# EasyEDA Pro project bldc-high-current-2-easyeda.epro, board PCB1
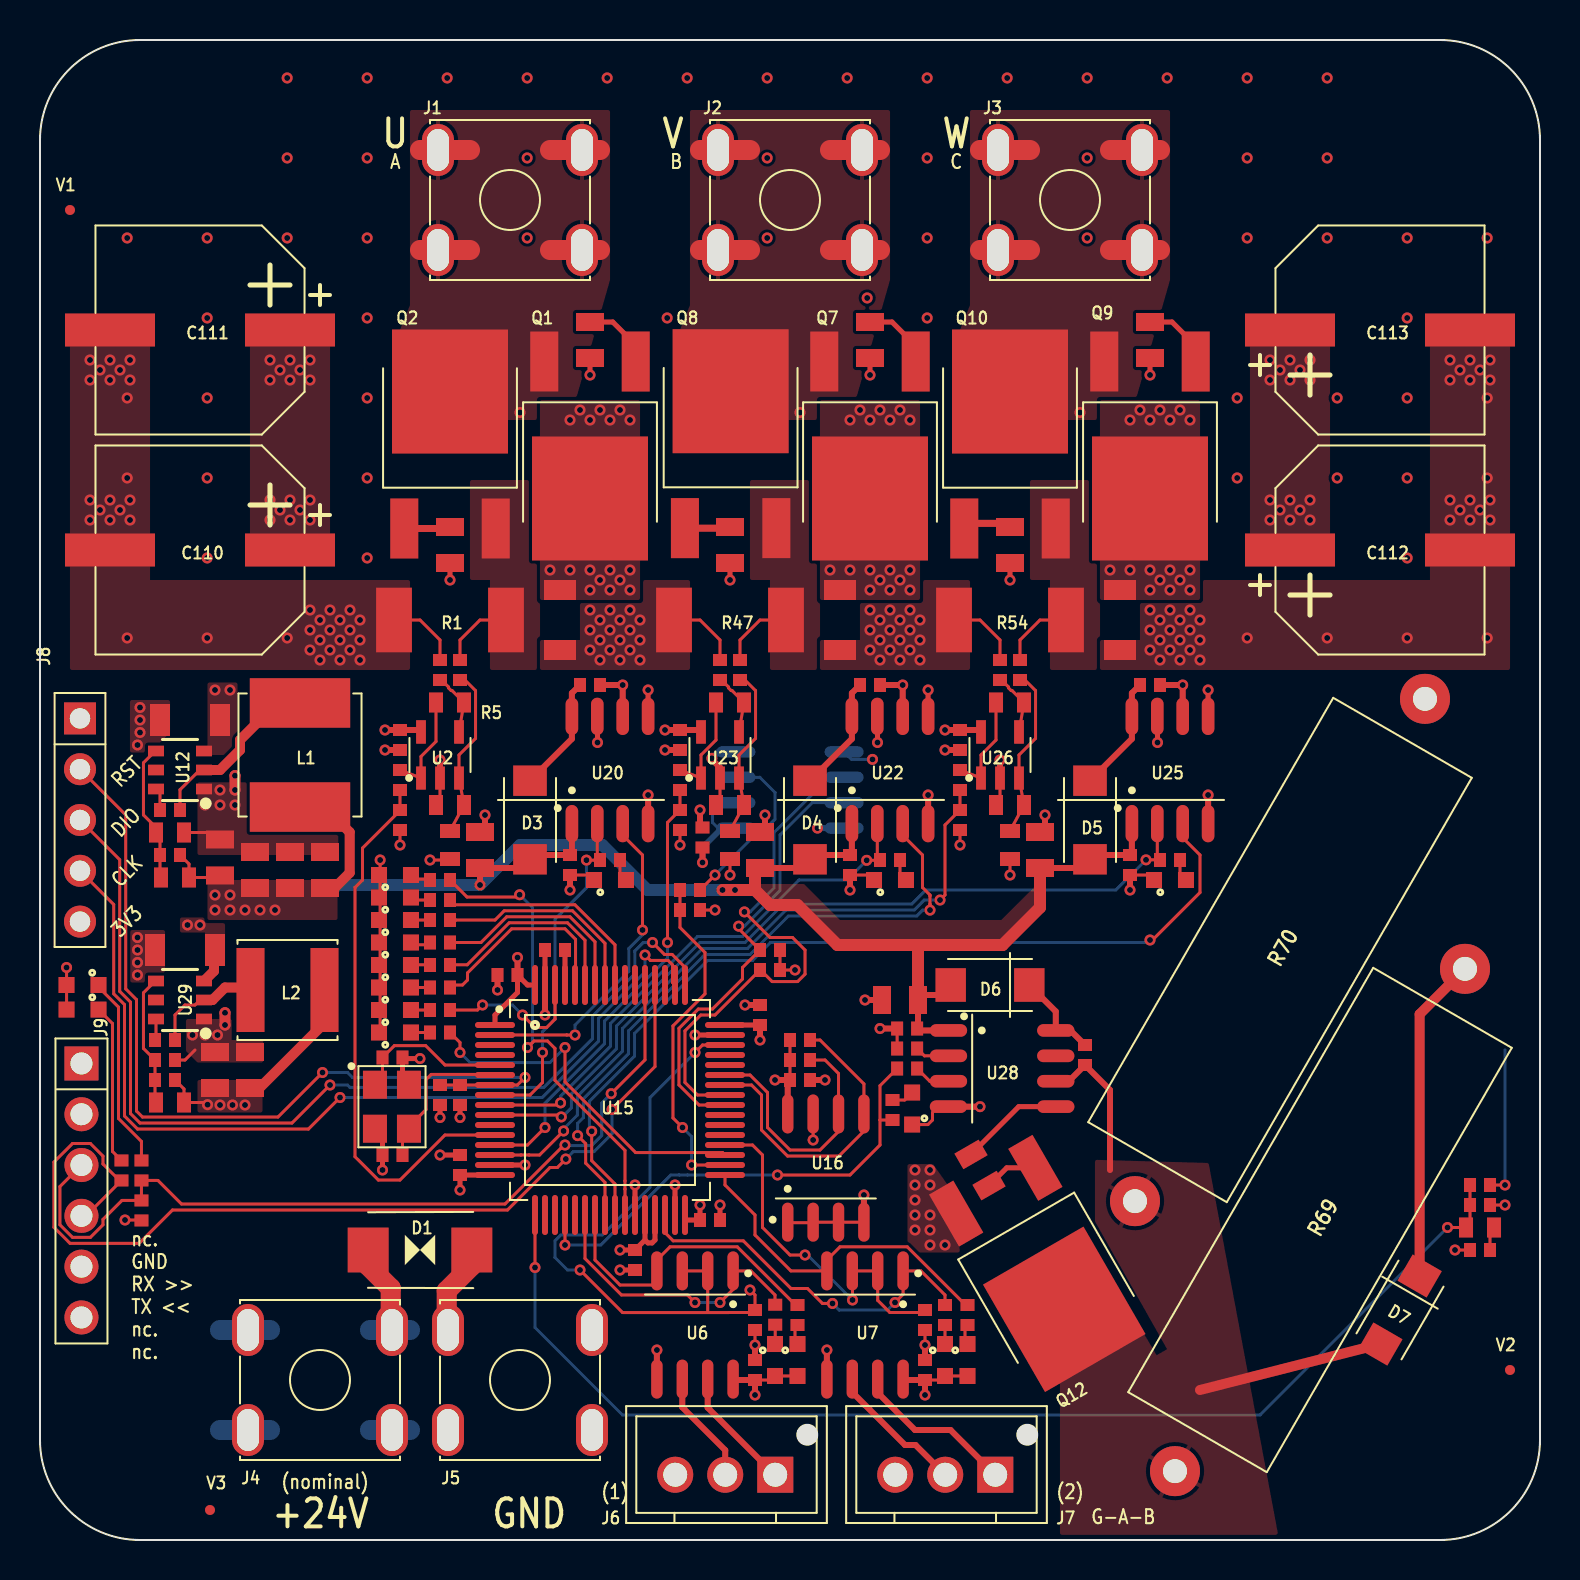
[diagram p3: board, top side]
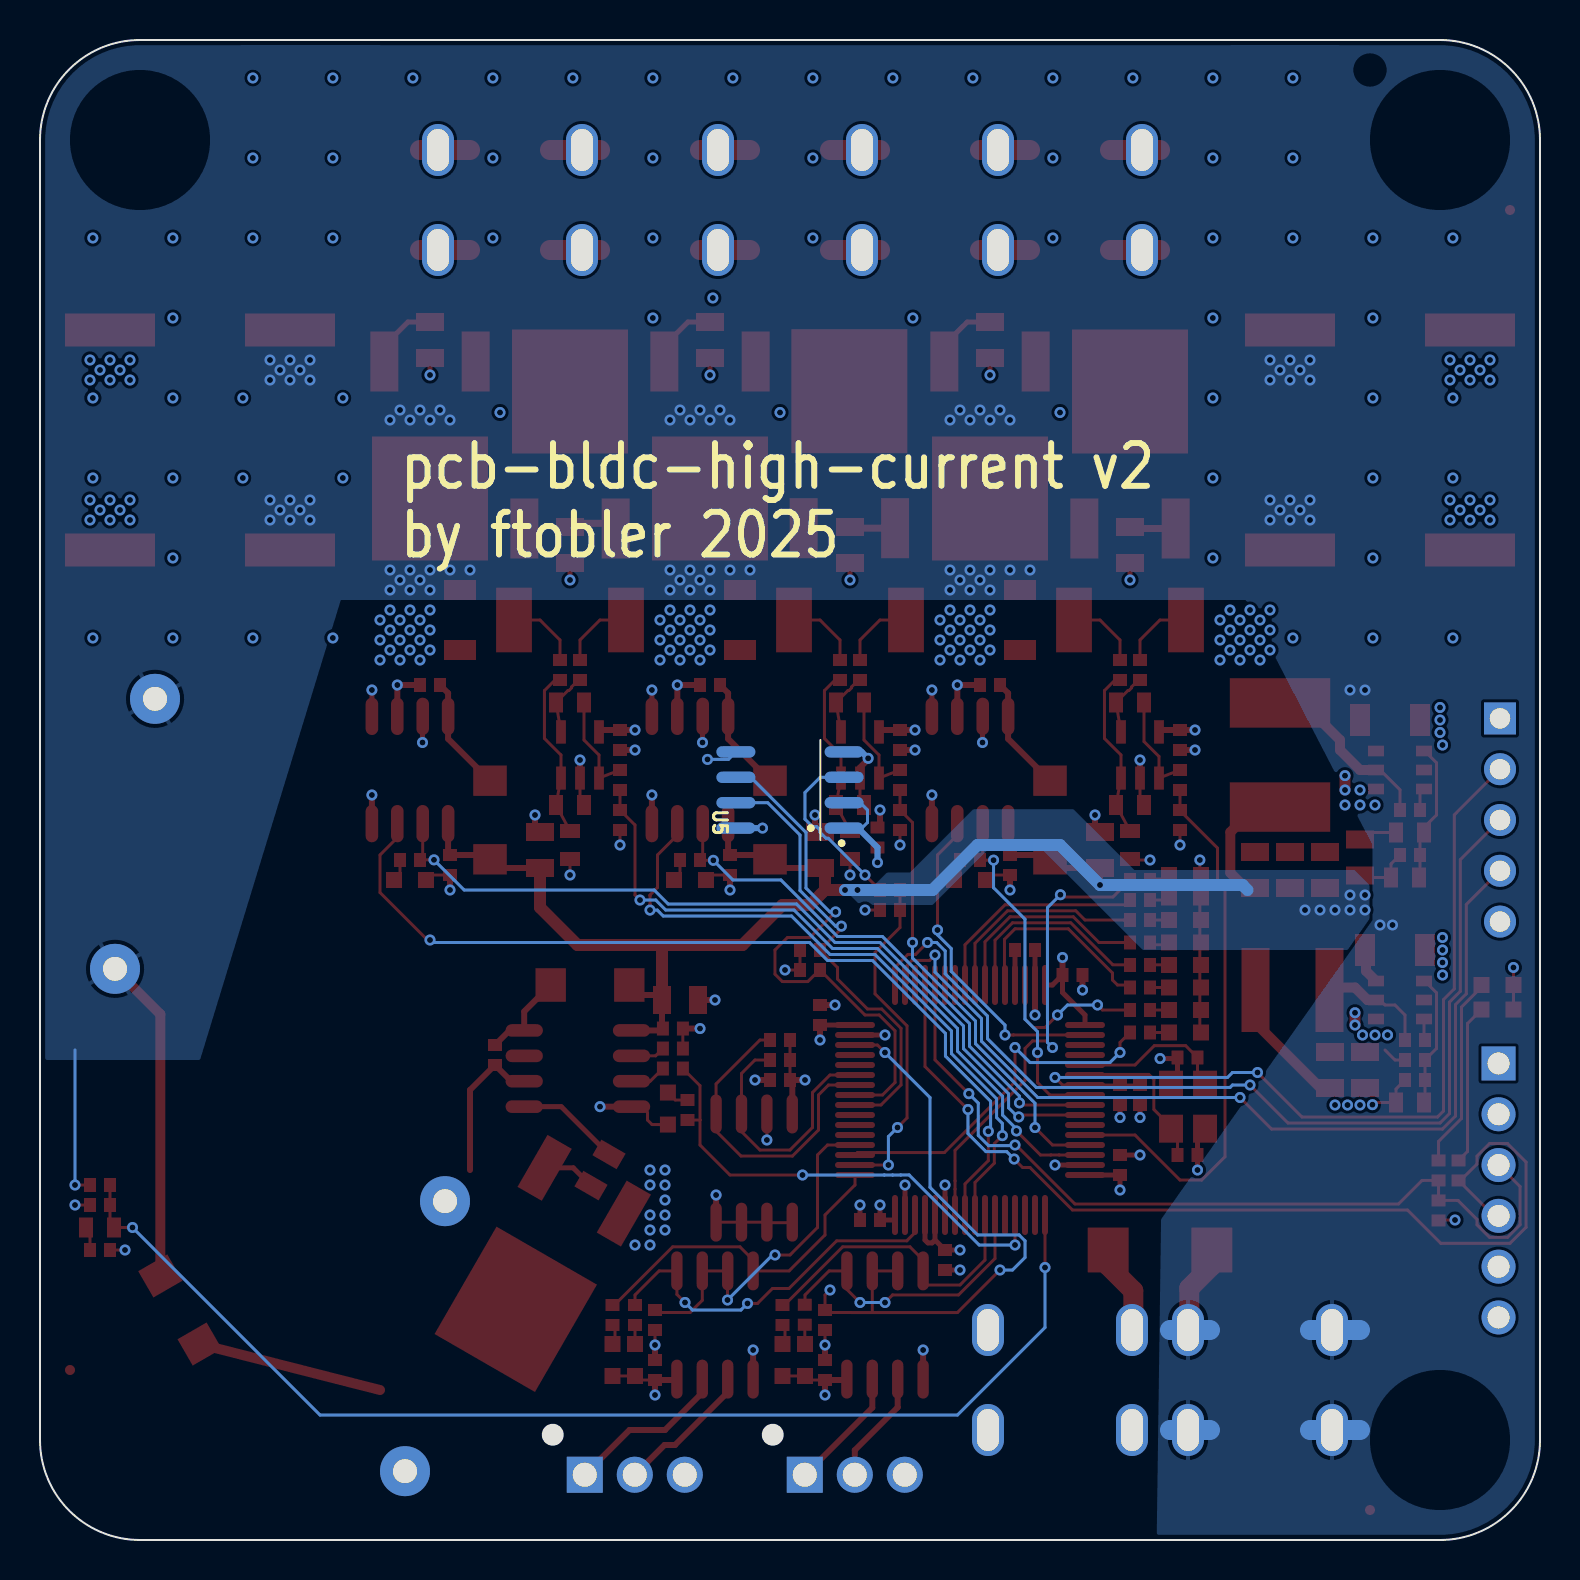
[diagram p4: board, bottom side, seen from below]

Outline 75 x 75 mm; copper layers: Top Layer, Inner1, Inner2, Bottom Layer. Coordinates in mm from the lower left corner of the outline.
Outline path: 0,70 arc(1.46,73.54) 5,75 70,75 arc(73.54,73.54) 75,70 75,5 arc(73.54,1.46) 70,0 5,0 arc(1.46,1.46) 0,5 0,70
Stack: Top Layer 0.035mm Outer layer thickness 1oz / Dielectric1 0.2104mm 7628 RC49% 8.6mil / Inner1 0.0152mm Inner layer thickness / Dielectric2 1.065mm 1.1mm H/HOZ Copper / Inner2 0.0152mm Inner layer thickness / Dielectric3 0.2104mm 7628 RC49% 8.6mil / Bottom Layer 0.035mm Outer layer thickness 1oz

## Design rules (mm)
template: Custom Config
spacing copperThickness1oz (default): track to track 0.15, other pairs 0.152 to 0.3
spacing copperThickness2oz: track to track 0.203, other pairs 0.152 to 0.3
track width copperThickness1oz (default): min 0.127, default 0.15, max 2.54
track width copperThickness2oz: min 0.203, default 0.254, max 2.54
differential pair differentialPair (default): width min 0.127, default 0.254, max 2.54; gap min 0.152, default 0.152
via viaSize (default): diameter min 0.55, default 0.55, max 10; hole min 0.3, default 0.3, max 6.3
net $1N1999 uses copperRegion No Spoke
net GND uses copperRegion No Spoke
net 3V3 uses copperRegion No Spoke
net OUT_A uses copperRegion No Spoke
net 12V uses copperRegion No Spoke
net $1N98362 uses copperRegion No Spoke
net $1N99332 uses copperRegion No Spoke
net OUT_BRAKE uses copperRegion No Spoke
net 24V uses copperRegion No Spoke
net OUT_B uses copperRegion No Spoke
net OUT_C uses copperRegion No Spoke

## Placement (name value [footprint] x y rotation side)
C4  1nF  [C0402]  32.5 31.5 180 top
C9  10uF  [C1206]  7.5 41 0 top
C43  1nF  [C0402]  18 36 90 top
C46  10pF  [C0402]  17.62 19.25 0 top
C47  10pF  [C0402]  17.62 24.12 180 top
C54  68pF  [C0603]  6.5 21.88 0 top
C55  47uF  [C0805]  8.75 23.5 270 top
C96  10uF  [C1206]  26 46 90 top
C97  10uF  [C1206]  40 46 90 top
C98  10uF  [C1206]  54 46 90 top
C100  10uF  [C1206]  7.25 29.5 0 top
C107  47uF  [C0805]  10.5 23.5 270 top
C109  68pF  [C0603]  6.75 33.13 0 top
C110  470uF  [CAP-SMD_BD10.0-L10.3-W10.3-FD]  8 49.5 180 top
C111  470uF  [CAP-SMD_BD10.0-L10.3-W10.3-FD]  8 60.5 180 top
C112  470uF  [CAP-SMD_BD10.0-L10.3-W10.3-FD]  67 49.5 0 top
C113  470uF  [CAP-SMD_BD10.0-L10.3-W10.3-FD]  67 60.5 0 top
C116  1nF  [C0402]  32 36 90 top
C117  1nF  [C0402]  46 36 90 top
C118  10uF  [C0805]  43 27 0 top
C119  10uF  [C0805]  22 34.5 270 top
C120  10uF  [C0805]  36 34.5 270 top
C121  10uF  [C0805]  50 34.5 270 top
C122  10uF  [C0805]  9 34.13 270 top
C123  10uF  [C0805]  10.75 33.5 270 top
C124  10uF  [C0805]  12.5 33.5 270 top
C125  10uF  [C0805]  14.25 33.5 270 top
C126  1nF  [C0402]  72 16.75 180 top
C137  100nF  [C0402]  6.25 25 180 top
C138  100nF  [C0402]  6.5 36.5 180 top
C139  100nF  [C0402]  26.5 33.75 90 top
C143  100nF  [C0402]  41.5 42.75 180 top
C144  100nF  [C0402]  54.5 33.75 90 top
C145  100nF  [C0402]  55.5 42.75 180 top
C146  100nF  [C0402]  46 40 90 top
C147  100nF  [C0402]  32 40 90 top
C148  100nF  [C0402]  43.36 25.57 0 top
C151  100nF  [C0402]  27.5 42.75 180 top
C152  100nF  [C0402]  18 40 90 top
C153  100nF  [C0402]  40.5 33.75 90 top
C154  100nF  [C0402]  52.25 24.25 90 top
C155  100nF  [C0402]  21 18.75 270 top
C156  100nF  [C0402]  29.75 14 90 top
C157  100nF  [C0402]  36 26.25 270 top
C158  100nF  [C0402]  23.38 28.25 0 top
C159  100nF  [C0402]  33.5 16 180 top
C160  100nF  [C0402]  44.25 8.5 270 top
C161  100nF  [C0402]  35.75 8.5 270 top
C162  100nF  [C0402]  33.12 35.12 270 top
C163  100nF  [C0402]  38 23 180 top
C164  100nF  [C0402]  20 22.25 90 top
D1  SMBJ24CA  [SMB_L4.6-W3.6-LS5.3-BI]  19 14.5 0 top
D3  SS14  [SMA_L4.2-W2.6-LS5.0-RD_1]  24.5 36 270 top
D4  SS14  [SMA_L4.2-W2.6-LS5.0-RD_1]  38.5 36 270 top
D5  SS14  [SMA_L4.2-W2.6-LS5.0-RD_1]  52.5 36 270 top
D6  SS14  [SMA_L4.2-W2.6-LS5.0-RD_1]  47.5 27.75 180 top
D7  SS14  [SMA_L4.2-W2.6-LS5.0-RD_1]  68 11.5 240 top
J1  T34080080-0680  [CONN-TH_T34080080-0680]  23.5 67 0 top
J2  T34080080-0680  [CONN-TH_T34080080-0680]  37.5 67 0 top
J3  T34080080-0680  [CONN-TH_T34080080-0680]  51.5 67 0 top
J4  T34080080-0680  [CONN-TH_T34080080-0680]  14 8 180 top
J5  T34080080-0680  [CONN-TH_T34080080-0680]  24 8 180 top
J6  B3B-XH-AM-BK(LF)(SN)  [CONN-TH_B3B-XH-AM-BK-LF-SN]  34.26 3.26 180 top
J7  B3B-XH-AM-BK(LF)(SN)  [CONN-TH_B3B-XH-AM-BK-LF-SN]  45.26 3.26 180 top
J8  PH2.54-1X5P-H25  [HDR-TH_5P-P2.54-V-M-3]  2 36 270 top
J9  PH2.54-06PB2G-H25  [HDR-TH_6P-P2.54-V-M_BLUE]  2.07 17.48 270 top
L1  12uH  [IND-SMD_L6.0-W6.0_SWPA6045S]  13 39.25 270 top
L2  6.8uH  [IND-SMD_L5.0-W5.0_SWPA5040S]  12.38 27.5 0 top
LED1  KT-0603R  [LED0603-RD]  17.75 33.25 0 top
LED2  KT-0603R  [LED0603-RD]  17.75 32.12 0 top
LED3  KT-0603R  [LED0603-RD]  17.75 31 0 top
LED4  KT-0603R  [LED0603-RD]  17.75 29.88 0 top
LED5  KT-0603R  [LED0603-RD]  17.75 28.75 0 top
LED6  KT-0603R  [LED0603-RD]  17.75 27.62 0 top
LED7  KT-0603R  [LED0603-RD]  17.75 26.5 0 top
LED8  KT-0603R  [LED0603-RD]  17.75 25.38 0 top
LED9  KT-0603R  [LED0603-RD]  37.88 9 270 top
LED10  KT-0603R  [LED0603-RD]  36.75 9 270 top
LED11  KT-0603R  [LED0603-RD]  46.38 9 270 top
LED12  KT-0603R  [LED0603-RD]  45.25 9 270 top
LED13  KT-0603R  [LED0603-RD]  2.12 27.75 180 top
LED14  KT-0603R  [LED0603-RD]  2.13 26.52 180 top
LED15  KT-0603R  [LED0603-RD]  43.61 21.57 90 top
LED16  KT-0603R  [LED0603-RD]  28.5 33 0 top
LED17  KT-0603R  [LED0603-RD]  42.5 33 0 top
LED18  KT-0603R  [LED0603-RD]  56.5 33 0 top
Q1  DOD100N04  [TO-252-2_L6.6-W6.2-P4.57-LS10.1-BR-CW]  27.5 55.5 90 top
Q2  DOD100N04  [TO-252-2_L6.6-W6.2-P4.57-LS10.1-BR-CW]  20.5 54 270 top
Q7  DOD100N04  [TO-252-2_L6.6-W6.2-P4.57-LS10.1-BR-CW]  41.5 55.5 90 top
Q8  DOD100N04  [TO-252-2_L6.6-W6.2-P4.57-LS10.1-BR-CW]  34.53 54.02 270 top
Q9  DOD100N04  [TO-252-2_L6.6-W6.2-P4.57-LS10.1-BR-CW]  55.5 55.5 90 top
Q10  DOD100N04  [TO-252-2_L6.6-W6.2-P4.57-LS10.1-BR-CW]  48.5 54 270 top
Q12  DOD100N04  [TO-252-2_L6.6-W6.2-P4.57-LS10.1-BR-CW]  49.5 14.5 120 top
R1  2mΩ  [RES-SMD_L6.4-W3.2-1]  20.5 46 0 top
R5  100kΩ  [R0603]  20.5 41.88 180 top
R6  100kΩ  [R0603]  20.5 36.75 180 top
R31  2.7kΩ  [R0603]  6.5 35.38 180 top
R39  51kΩ  [R0402]  6.5 34.25 0 top
R44  100kΩ  [R0603]  34.5 41.88 180 top
R45  100kΩ  [R0603]  34.5 36.75 180 top
R47  2mΩ  [RES-SMD_L6.4-W3.2-1]  34.5 46 0 top
R51  100kΩ  [R0603]  48.5 41.88 180 top
R52  100kΩ  [R0603]  48.5 36.75 180 top
R54  2mΩ  [RES-SMD_L6.4-W3.2-1]  48.5 46 0 top
R69  10Ω  [RES-TH_BD8.0-L24.5-P28.50-D0.8]  64 16 60 top
R70  10Ω  [RES-TH_BD8.0-L24.5-P28.50-D0.8]  62 29.5 60 top
R71  20Ω  [R0805]  27.5 60 90 top
R72  20Ω  [R0805]  20.5 49.75 90 top
R73  20Ω  [R0805]  41.5 60 90 top
R74  20Ω  [R0805]  34.5 49.75 90 top
R75  20Ω  [R0805]  55.5 60 90 top
R76  20Ω  [R0805]  48.5 49.75 90 top
R77  20Ω  [R0805]  47 18.5 300 top
R80  15kΩ  [R0402]  6.25 23 0 top
R81  3.3kΩ  [R0402]  6.25 24 180 top
R82  10MΩ  [R0603]  20.5 34.75 270 top
R83  10MΩ  [R0603]  34.5 34.75 270 top
R84  10MΩ  [R0603]  48.5 34.75 270 top
R85  3.3kΩ  [R0402]  21 43.5 90 top
R86  3.3kΩ  [R0402]  20 43.5 90 top
R87  3.3kΩ  [R0402]  35 43.5 90 top
R88  3.3kΩ  [R0402]  34 43.5 90 top
R89  3.3kΩ  [R0402]  49 43.5 90 top
R90  3.3kΩ  [R0402]  48 43.5 90 top
R91  2.7kΩ  [R0603]  72 15.62 180 top
R92  51kΩ  [R0402]  72 17.75 0 top
R93  3.3kΩ  [R0402]  72 14.5 0 top
R94  3.3kΩ  [R0402]  18 38 90 top
R95  3.3kΩ  [R0402]  32 38 90 top
R96  3.3kΩ  [R0402]  46 38 90 top
R97  3.3kΩ  [R0402]  43.36 24.57 180 top
R98  3.3kΩ  [R0402]  43.36 23.57 0 top
R99  15kΩ  [R0402]  21 22.25 270 top
R100  15kΩ  [R0402]  44.25 11 90 top
R101  15kΩ  [R0402]  35.75 11 90 top
R102  3.3kΩ  [R0402]  38 24 180 top
R103  3.3kΩ  [R0402]  38 25 180 top
R104  3.3kΩ  [R0402]  36.5 29.5 0 top
R105  3.3kΩ  [R0402]  36.5 28.5 0 top
R106  3.3kΩ  [R0402]  25.75 29.5 0 top
R107  3.3kΩ  [R0402]  32.5 32.5 180 top
R108  3.3kΩ  [R0402]  20 33 180 top
R109  3.3kΩ  [R0402]  20 32 180 top
R110  3.3kΩ  [R0402]  20 31 180 top
R111  3.3kΩ  [R0402]  20 29.88 180 top
R112  3.3kΩ  [R0402]  20 28.75 180 top
R113  3.3kΩ  [R0402]  20 27.62 180 top
R114  3.3kΩ  [R0402]  20 26.5 180 top
R115  3.3kΩ  [R0402]  20 25.38 180 top
R116  15kΩ  [R0402]  5.07 16.48 270 top
R117  3.3kΩ  [R0402]  37.88 11.25 270 top
R118  3.3kΩ  [R0402]  36.76 11.26 270 top
R119  3.3kΩ  [R0402]  46.38 11.25 270 top
R120  3.3kΩ  [R0402]  45.25 11.25 270 top
R121  3.3kΩ  [R0402]  5.07 18.48 90 top
R122  3.3kΩ  [R0402]  4.07 18.48 90 top
R123  3.3kΩ  [R0402]  42.62 21.5 90 top
R124  3.3kΩ  [R0402]  28.5 34 0 top
R125  3.3kΩ  [R0402]  42.5 34 0 top
R126  3.3kΩ  [R0402]  56.5 34 0 top
U2  TLV9061IDBVR  [SOT-23-5_L3.0-W1.7-P0.95-LS2.8-BL]  20 39.25 0 top
U5  AS5600-ASOM  [SOIC-8_L5.0-W4.0-P1.27-LS6.0-BL]  37.5 37.5 90 bottom
U6  SP3485EN-L/TR  [SOIC-8_L5.0-W4.0-P1.27-LS6.0-BL]  32.75 10.75 180 top
U7  SP3485EN-L/TR  [SOIC-8_L5.0-W4.0-P1.27-LS6.0-BL]  41.25 10.75 180 top
U12  TPS54302DDCT  [TSOT-23-6_L2.9-W1.6-P0.95-LS2.8-BR]  7 38.5 0 top
U15  STM32G474RBT6  [LQFP-64_L10.0-W10.0-P0.50-LS12.0-BL]  28.5 22 270 top
U16  M24C64-RMN6TP  [SOIC-8_L5.0-W4.0-P1.27-LS6.0-BL]  39.29 18.6 0 top
U20  LKS523  [SOP-8_L4.9-W3.9-P1.27-LS6.0-BL]  28.5 38.5 0 top
U22  LKS523  [SOP-8_L4.9-W3.9-P1.27-LS6.0-BL]  42.5 38.5 0 top
U23  TLV9061IDBVR  [SOT-23-5_L3.0-W1.7-P0.95-LS2.8-BL]  34 39.25 0 top
U25  LKS523  [SOP-8_L4.9-W3.9-P1.27-LS6.0-BL]  56.5 38.5 0 top
U26  TLV9061IDBVR  [SOT-23-5_L3.0-W1.7-P0.95-LS2.8-BL]  48 39.25 0 top
U28  LKS523  [SOP-8_L4.9-W3.9-P1.27-LS6.0-BL]  48.11 23.57 270 top
U29  TPS54302DDCT  [TSOT-23-6_L2.9-W1.6-P0.95-LS2.8-BR]  7 27 0 top
V1  Fiducial  [Fiducial:Fiducial_0.5mm_Mask1mm]  1.5 66.5 0 top
V2  Fiducial  [Fiducial:Fiducial_0.5mm_Mask1mm]  73.5 8.5 0 top
V3  Fiducial  [Fiducial:Fiducial_0.5mm_Mask1mm]  8.5 1.5 0 top
X1  25MHz  [CRYSTAL-SMD_4P-L3.2-W2.5-BL]  17.6 21.66 270 top

## Footprints (pads in the part's own frame, mm; a bottom-side part is the same pattern mirrored in y, then rotated)
C0402
  rect 0.6x0.7 smd: 1(-0.5,0) 2(0.5,0)
C0603
  rect 0.7x1 smd: 1(-0.7,0) 2(0.7,0)
C0805
  rect 0.9x1.4 smd: 1(-0.9,0) 2(0.9,0)
C1206
  rect 1x1.6 smd: 1(-1.5,0) 2(1.5,0)
CAP-SMD_BD10.0-L10.3-W10.3-FD
  rect 4.5x1.65 smd: 1(-4.5,0) 2(4.5,0)
CONN-TH_B3B-XH-AM-BK-LF-SN
  rect 1.8x1.8 hole 1.2: 1(-2.5,0)
  round 1.8 hole 1.2: 2(0,0) 3(2.5,0)
CONN-TH_T34080080-0680
  oval 1.6x2.6 hole 1.1x2.1: 1(-3.6,-2.5) 2(3.6,-2.5) 3(3.6,2.5) 4(-3.6,2.5)
CRYSTAL-SMD_4P-L3.2-W2.5-BL
  rect 1.4x1.2 smd: 1(-1.1,-0.85) 2(1.1,-0.85) 3(1.1,0.85) 4(-1.1,0.85)
Fiducial:Fiducial_0.5mm_Mask1mm
  round 0.5 smd: (0,0)
HDR-TH_5P-P2.54-V-M-3
  rect 1.6x1.6 hole 1.02: 1(-5.08,0)
  round 1.6 hole 1.02: 2(-2.54,0) 3(0,0) 4(2.54,0) 5(5.08,0)
HDR-TH_6P-P2.54-V-M_BLUE
  rect 1.7x1.7 hole 1.1: 1(-6.35,0)
  round 1.7 hole 1.1: 2(-3.81,0) 3(-1.27,0) 4(1.27,0) 5(3.81,0) 6(6.35,0)
IND-SMD_L5.0-W5.0_SWPA5040S
  rect 1.4x4.2 smd: 1(-1.85,0) 2(1.85,0)
IND-SMD_L6.0-W6.0_SWPA6045S
  rect 2.474x5.02 smd: 1(-2.603,0) 2(2.603,0)
LED0603-RD
  rect 0.8x0.8 smd: 1(-0.799,0) 2(0.799,0)
LQFP-64_L10.0-W10.0-P0.50-LS12.0-BL
  oval 0.3x2 smd: 1(-3.75,-5.75) 2(-3.25,-5.75) 3(-2.75,-5.75) 4(-2.25,-5.75) 5(-1.75,-5.75) 6(-1.25,-5.75) 7(-0.75,-5.75) 8(-0.25,-5.75) 9(0.25,-5.75) 10(0.75,-5.75) 11(1.25,-5.75) 12(1.75,-5.75) 13(2.25,-5.75) 14(2.75,-5.75) 15(3.25,-5.75) 16(3.75,-5.75) 33(3.75,5.75) 34(3.25,5.75) 35(2.75,5.75) 36(2.25,5.75) 37(1.75,5.75) 38(1.25,5.75) 39(0.75,5.75) 40(0.25,5.75) 41(-0.25,5.75) 42(-0.75,5.75) 43(-1.25,5.75) 44(-1.75,5.75) 45(-2.25,5.75) 46(-2.75,5.75) 47(-3.25,5.75) 48(-3.75,5.75)
  oval 2x0.3 smd: 17(5.75,-3.75) 18(5.75,-3.25) 19(5.75,-2.75) 20(5.75,-2.25) 21(5.75,-1.75) 22(5.75,-1.25) 23(5.75,-0.75) 24(5.75,-0.25) 25(5.75,0.25) 26(5.75,0.75) 27(5.75,1.25) 28(5.75,1.75) 29(5.75,2.25) 30(5.75,2.75) 31(5.75,3.25) 32(5.75,3.75) 49(-5.75,3.75) 50(-5.75,3.25) 51(-5.75,2.75) 52(-5.75,2.25) 53(-5.75,1.75) 54(-5.75,1.25) 55(-5.75,0.75) 56(-5.75,0.25) 57(-5.75,-0.25) 58(-5.75,-0.75) 59(-5.75,-1.25) 60(-5.75,-1.75) 61(-5.75,-2.25) 62(-5.75,-2.75) 63(-5.75,-3.25) 64(-5.75,-3.75)
R0402
  rect 0.6x0.7 smd: 1(-0.5,0) 2(0.5,0)
R0603
  rect 0.7x1 smd: 1(-0.7,0) 2(0.7,0)
R0805
  rect 0.9x1.4 smd: 1(-0.9,0) 2(0.9,0)
RES-SMD_L6.4-W3.2-1
  rect 1.79x3.23 smd: 1(-2.8,0) 2(2.8,0)
RES-TH_BD8.0-L24.5-P28.50-D0.8
  round 2.5 hole 1.2: 1(-14.5,0) 2(14.5,0)
SMA_L4.2-W2.6-LS5.0-RD_1
  rect 1.52x1.68 smd: 1(-1.965,0) 2(1.965,0)
SMB_L4.6-W3.6-LS5.3-BI
  rect 2.047x2.241 smd: 1(-2.591,0) 2(2.591,0)
SOIC-8_L5.0-W4.0-P1.27-LS6.0-BL
  oval 0.569x1.95 smd: 1(-1.905,-2.705) 2(-0.635,-2.705) 3(0.635,-2.705) 4(1.905,-2.705) 5(1.905,2.705) 6(0.635,2.705) 7(-0.635,2.705) 8(-1.905,2.705)
SOP-8_L4.9-W3.9-P1.27-LS6.0-BL
  oval 0.63x1.865 smd: 1(-1.905,-2.683) 2(-0.635,-2.683) 3(0.635,-2.683) 4(1.905,-2.683) 5(1.905,2.683) 6(0.635,2.683) 7(-0.635,2.683) 8(-1.905,2.683)
SOT-23-5_L3.0-W1.7-P0.95-LS2.8-BL
  rect 0.49x1.157 smd: 1(-0.95,-1.153) 2(0,-1.153) 3(0.95,-1.153)
  rect 0.49x1.175 smd: 4(0.95,1.153) 5(-0.95,1.153)
TO-252-2_L6.6-W6.2-P4.57-LS10.1-BR-CW
  rect 3x1.4 smd: 1(3.424,-2.286) 3(3.424,2.286)
  rect 6.2x5.8 smd: 2(-3.424,0)
TSOT-23-6_L2.9-W1.6-P0.95-LS2.8-BR
  rect 0.8x0.532 smd: 1(1.2,-0.95) 2(1.2,0) 3(1.2,0.95) 4(-1.2,0.95) 5(-1.2,0) 6(-1.2,-0.95)

## Nets
As in the schematic.

Pads without a net: J9 1 5 6; U12 5; U15 3 4 11 18 19 21 37 38 39 44 45 51 54 55; U28 7; U29 5

## Via types
v1: diameter 0.55, hole 0.3, Top Layer to Bottom Layer, 435 vias

## Routing (per net, layer and track width the routed paths; a pad name or vN(x,y) marks a point on that pad's centre or on a via; arc(x,y) is an arc through that point)
3V3: length 58.4
  Top Layer w0.15: 46.25,8.2 LED12.2 45.05,8 C160.2 ; R82.2 20.45,34 v1(19.5,34) ; C161.2 36.55,8 LED10.2 37.75,8.2 ; R103.2 R102.2 C163.2 ; R83.2 v1(34.5,33.25) ; v1(37.75,28.5) R105.2 R104.2 ; R84.2 v1(48.5,33.25) ; v1(1.33,28.62) LED14.2 ; R116.2 5.05,16 v1(4.25,16) ; v1(8.38,21.77) 8.27,21.88 C54.2 7.2,22.55 R80.2
  Top Layer w0.25: U15.32 32.25,16 C159.2 v1(33,16.75) ; R99.2 v1(21,21.12) ; v1(21,17.5) C155.2 U15.16 ; U15.48 C157.2 ; U15.64 24.38,27.75 C158.2 23.88,27.38 22.75,26.25 U15.1 ; 30.25,15 U15.28 ; 30.25,15 30.4,14.85 30.6,14.85 30.75,15 U15.29 ; 30.25,15 C156.2 v1(29,14.5)
  Top Layer w0.3: U7.8 43.2,8 C160.2 v1(44.25,7.25) ; v1(35.75,7.25) C161.2 34.7,8 U6.8 ; U26.5 46.95,40.5 C146.2 v1(45.25,40.5) ; v1(17.25,40.5) C152.2 18.95,40.5 U2.5 ; C157.2 v1(36,25) ; U23.5 32.95,40.5 C147.2 v1(31.25,40.5) ; 33.13,34.5 v1(33.13,33.88) ; v1(36.75,23) C163.2 37.39,22.89 U16.8 ; C158.2 v1(23.88,29.12)
  Top Layer w0.5: C107.2 10.97,22.6 14.6,26.22 14.6,27.5
  Bottom Layer w0.15: U5.5 40.58,39.03 v1(41.62,39.03) ; U5.2 33.99,36.86 33.62,36.5 33.62,35.88 33.91,35.59 34.09,35.59
  Bottom Layer w0.3: v1(33.13,33.88) 33.13,34.63 34.09,35.59
  vias: v1(9,21.75) v1(9.62,21.75) v1(10.25,21.75)
12V: length 80.2
  Top Layer w0.15: R39.2 7.45,33.8 C109.2 8.9,33.13 C122.2
  Top Layer w0.3: v1(22,32.75) C119.2 24.06,33.6 D3.2 24.72,34.25 C139.2 26.59,34.34 U20.1 ; U22.1 40.59,34.34 C153.2 38.72,34.25 D4.2 38.06,33.6 C120.2 ; U25.1 54.59,34.34 C144.2 52.72,34.25 D5.2 52.06,33.6 C121.2 ; U28.1 43.95,25.48 C148.2 43.9,25.62 C118.2 44.15,27.25 45.03,27.25 D6.2
  Top Layer w0.5: L1.2 13.77,35.88 15,35.88 15.48,35.39 15.48,33.36 14.72,32.6 C125.2
  Top Layer w0.6: C121.2 50,31.62 48.12,29.75 43.87,29.75 ; C118.2 43.9,29.72 43.87,29.75 ; 35.75,32.5 36.5,31.75 37.88,31.75 39.88,29.75 43.87,29.75 ; 35.75,32.5 v1(34.75,32.5) v1(34.12,32.5) ; 35.75,32.5 35.75,33.35 C120.2
  Bottom Layer w0.6: v1(34.75,32.5) v1(34.12,32.5) 30.38,32.5 28.12,34.75 24,34.75 v1(22,32.75) 14.88,32.75 14.62,32.5
  vias: v1(8.75,32.25) v1(8.75,31.5) v1(9.5,32.25) v1(9.5,31.5) v1(10.25,31.5) v1(11,31.5) v1(11.75,31.5)
24V: length 39
  Top Layer w0.15: R92.2 v1(73.25,17.75)
  Top Layer w0.5: R69.2 68.98,26.29 D7.1 ; U29.3 8.7,28.45 8.7,29.45 C100.2
  Top Layer w1: D1.1 16.41,13.72 17.54,12.59 17.54,10.5
  Bottom Layer w0.15: v1(73.25,17.75) 73.25,24.5
  Bottom Layer w1: 16.5,5.5 J4.4 18.5,5.5 ; 11.5,5.5 J4.3 9,5.5 ; 11.5,10.5 J4.2 9,10.5 ; 16.5,10.5 J4.1 18.5,10.5
  vias: v1(7.38,30.75) v1(8,30.75) v1(8.75,42.5) v1(9.5,42.5) v1(11.5,59) v1(11.5,58) v1(11.5,52) v1(11.5,51) v1(12,58.5) v1(12,51.5) v1(12.5,59) v1(12.5,58) v1(12.5,52) v1(12.5,51) v1(13,58.5) v1(13,51.5) v1(13.5,59) v1(13.5,58) v1(13.5,52) v1(13.5,51) v1(25.5,48.5) v1(26.5,56) v1(26.5,48.5) v1(27,56.5) v1(27.5,56) v1(27.5,48.5) v1(27.5,47.5) v1(28,56.5) v1(28,48) v1(28.5,56) v1(28.5,48.5) v1(28.5,47.5) v1(29,56.5) v1(29,48) v1(29.5,56) v1(29.5,48.5) v1(29.5,47.5) v1(39.5,48.5) v1(40.5,56) v1(40.5,48.5) v1(41,56.5) v1(41.5,56) v1(41.5,48.5) v1(41.5,47.5) v1(42,56.5) v1(42,48) v1(42.5,56) v1(42.5,48.5) v1(42.5,47.5) v1(43,56.5) v1(43,48) v1(43.5,56) v1(43.5,48.5) v1(43.5,47.5) v1(53.5,48.5) v1(54.5,56) v1(54.5,48.5) v1(55,56.5) v1(55.5,56) v1(55.5,48.5) v1(55.5,47.5) v1(56,56.5) v1(56,48) v1(56.5,56) v1(56.5,48.5) v1(56.5,47.5) v1(57,56.5) v1(57,48) v1(57.5,56) v1(57.5,48.5) v1(57.5,47.5) v1(61.5,59) v1(61.5,58) v1(61.5,52) v1(61.5,51) v1(62,58.5) v1(62,51.5) v1(62.5,59) v1(62.5,58) v1(62.5,52) v1(62.5,51) v1(63,58.5) v1(63,51.5) v1(63.5,59) v1(63.5,58) v1(63.5,52) v1(63.5,51)
GND: length 107.8
  Top Layer w0.15: C122.1 8.65,35.38 R31.1 ; R90.2 48,45 47,46 R54.1 ; LED16.1 27.45,33.25 C139.1 ; U28.4 44.92,21.67 44.62,21.38 44.62,21 44.4,20.77 43.61,20.77 ; R101.1 v1(35.75,9.75) ; U16.7 v1(38.66,20) ; R52.2 48,36.95 48,38.1 ; LED18.1 55.45,33.25 C144.1 ; C117.1 v1(46,34.75) ; R88.2 34,45 33,46 R47.1 ; 17.01,25.64 v1(17.01,34) ; 34,38.1 34,36.95 R45.2 ; 41.8,33.07 41.62,33.25 C153.1 ; U16.1 37.41,15.86 38.63,15.86 U16.2 U16.3 U16.4 ; C43.1 v1(18,34.75) ; R1.1 19,46 20,45 R86.2 ; R81.1 7.25,24 7.75,24.5 ; R97.2 C148.1 ; C4.1 v1(33.75,31.5) ; C126.1 v1(73.25,16.75) ; C116.1 v1(32,34.75) ; R6.2 20,36.95 20,38.1 ; R100.1 v1(44.25,9.75) ; R93.1 v1(70.75,14.5)
  Top Layer w0.25: X1.2 17.12,20.19 C46.1 v1(17.12,18.5) ; v1(19,24.07) 18.18,24.07 C47.1 18.12,23.09 X1.4 ; C156.1 v1(29,13.5) ; U15.15 v1(24.25,18.75) ; U15.27 v1(29.75,17.75) ; U15.47 v1(32.75,25.25) ; C155.1 v1(20,19.25) ; U15.31 v1(31.75,17.75) ; C164.1 v1(20,21.12) ; C159.1 v1(34,16.75) ; R106.1 U15.63
  Top Layer w0.3: C144.1 v1(54.5,32.5) ; C121.1 50.25,35.65 v1(50.25,36.25) ; 48,38.1 v1(48,39) ; U28.4 v1(47,21.67) ; C139.1 v1(26.5,32.5) ; C146.1 v1(45.25,39.5) ; 34,38.1 34,38.62 33.59,39.03 v1(33.59,39.08) ; C118.1 v1(41.25,27) ; C153.1 v1(40.5,32.5) ; C163.1 v1(39.25,23) ; U22.4 v1(44.41,37.25) ; U7.5 v1(39.34,9.5) ; 20,38.1 v1(20,39) ; C158.1 v1(22.88,27.5) ; v1(22.25,36.25) 22.25,35.65 C119.1 ; v1(33,36.5) 33,35.63 33.13,35.5 ; C157.1 v1(35.25,26.75) ; U15.63 v1(25.25,26.25) ; C161.1 v1(35.75,9.75) ; C152.1 v1(17.25,39.5) ; v1(36.25,36.25) 36.25,35.65 C120.1 ; U25.4 v1(58.41,37.25) ; C147.1 v1(31.25,39.5) ; U16.4 v1(41.2,17.25) ; U20.4 v1(30.41,37.25) ; C160.1 v1(44.25,9.75) ; C148.1 v1(42,25.57) ; U6.5 v1(30.84,9.5)
  Top Layer w0.55: v1(9.75,38.22) v1(9.75,37.5) ; v1(9.25,26.36) v1(9.25,25.75)
  Top Layer w1: 20.34,10.5 20.34,12.46 21.59,13.72 D1.2
  Inner1 w1: 19.05,10.5 J5.2 21.5,10.5 ; 26.5,10.5 J5.1 29,10.5 ; 26.5,5.5 J5.4 29,5.5 ; 21.5,5.5 J5.3 19.07,5.5
  Bottom Layer w0.3: v1(33.59,39.08) 33.91,39.41 U5.4 ; U5.8 v1(38.88,35.59)
  vias: v1(2.5,59) v1(2.5,58) v1(2.5,52) v1(2.5,51) v1(3,58.5) v1(3,51.5) v1(3.5,59) v1(3.5,58) v1(3.5,52) v1(3.5,51) v1(4,58.5) v1(4,51.5) v1(4.36,65.1) v1(4.36,57.1) v1(4.36,53.1) v1(4.36,45.1) v1(4.5,59) v1(4.5,58) v1(4.5,52) v1(4.5,51) v1(4.88,39.75) v1(4.88,30.12) v1(4.88,29.5) v1(4.88,28.88) v1(4.88,28.25) v1(5,41.63) v1(5,41) v1(5,40.38) v1(7.62,25.25) v1(8.25,36.75) v1(8.25,25.25) v1(8.36,65.1) v1(8.36,61.1) v1(8.36,57.1) v1(8.36,53.1) v1(8.36,49.1) v1(8.36,45.1) v1(8.88,25.25) v1(9,37.5) v1(9,36.75) v1(9.75,36.75) v1(12.36,73.1) v1(12.36,69.1) v1(12.36,65.1) v1(12.36,45.1) v1(13.5,46.5) v1(13.5,45.5) v1(13.5,44.5) v1(14,46) v1(14,45) v1(14,44) v1(14.5,46.5) v1(14.5,45.5) v1(14.5,44.5) v1(15,46) v1(15,45) v1(15,44) v1(15.5,46.5) v1(15.5,45.5) v1(15.5,44.5) v1(16,46) v1(16,45) v1(16,44) v1(16.36,73.1) v1(16.36,69.1) v1(16.36,65.1) v1(16.36,61.1) v1(16.36,57.1) v1(16.36,53.1) v1(16.36,49.1) v1(20.36,73.1) v1(24.36,73.1) v1(24.36,69.1) v1(24.36,65.1) v1(27.5,46.5) v1(27.5,45.5) v1(27.5,44.5) v1(28,46) v1(28,45) v1(28,44) v1(28.36,73.1) v1(28.5,46.5) v1(28.5,45.5) v1(28.5,44.5) v1(29,46) v1(29,45) v1(29,44) v1(29.5,46.5) v1(29.5,45.5) v1(29.5,44.5) v1(30,46) v1(30,45) v1(30,44) v1(31.36,61.1) v1(32.36,73.1) v1(36.36,73.1) v1(36.36,69.1) v1(36.36,65.1) v1(40.36,73.1) v1(41.36,62.1) v1(41.5,46.5) v1(41.5,45.5) v1(41.5,44.5) v1(42,46) v1(42,45) v1(42,44) v1(42.5,46.5) v1(42.5,45.5) v1(42.5,44.5) v1(43,46) v1(43,45) v1(43,44) v1(43.5,46.5) v1(43.5,45.5) v1(43.5,44.5) v1(43.75,18.5) v1(43.75,17.75) v1(43.75,17) v1(43.75,16.25) v1(43.75,15.5) v1(44,46) v1(44,45) v1(44,44) v1(44.36,73.1) v1(44.36,69.1) v1(44.36,65.1) v1(44.36,61.1) v1(44.5,18.5) v1(44.5,17.75) v1(44.5,16.25) v1(44.5,15.5) v1(44.5,14.75) v1(45.25,14.75) v1(48.36,73.1) v1(52.36,73.1) v1(52.36,69.1) v1(52.36,65.1) v1(55.5,46.5) v1(55.5,45.5) v1(55.5,44.5) v1(56,46) v1(56,45) v1(56,44) v1(56.36,73.1) v1(56.5,46.5) v1(56.5,45.5) v1(56.5,44.5) v1(57,46) v1(57,45) v1(57,44) v1(57.5,46.5) v1(57.5,45.5) v1(57.5,44.5) v1(58,46) v1(58,45) v1(58,44) v1(59.86,57.1) v1(59.86,53.1) v1(60.36,73.1) v1(60.36,69.1) v1(60.36,65.1) v1(60.36,45.1) v1(64.36,73.1) v1(64.36,69.1) v1(64.36,65.1) v1(64.36,45.1) v1(64.86,57.1) v1(64.86,53.1) v1(68.36,65.1) v1(68.36,61.1) v1(68.36,57.1) v1(68.36,53.1) v1(68.36,49.1) v1(68.36,45.1) v1(70.5,59) v1(70.5,58) v1(70.5,52) v1(70.5,51) v1(71,58.5) v1(71,51.5) v1(71.5,59) v1(71.5,58) v1(71.5,52) v1(71.5,51) v1(72,58.5) v1(72,51.5) v1(72.36,65.1) v1(72.36,57.1) v1(72.36,53.1) v1(72.36,45.1) v1(72.5,59) v1(72.5,58) v1(72.5,52) v1(72.5,51)
1_485_A: length 5.7
  Top Layer w0.3: U6.6 32.12,6.63 34.26,4.49 J6.2
1_485_B: length 6.2
  Top Layer w0.3: U6.7 33.38,6.62 36.74,3.26 J6.1
2_485_A: length 7
  Top Layer w0.3: U7.6 40.62,7.38 43.25,4.75 43.77,4.75 J7.2
2_485_B: length 8.3
  Top Layer w0.3: U7.7 41.88,7.37 43.75,5.5 45.52,5.5 J7.1
CURR_A: length 27.7
  Top Layer w0.15: U15.12 20.25,20.25 18,18 16.92,18 15.75,19.17 15.75,32.62 16.12,33 16.12,34.6 18,36.47 C43.2 R94.1
CURR_B: length 22.5
  Top Layer w0.15: U15.13 24.38,19.75 v1(25.25,20.62) ; R95.1 C116.2 31.38,35.88 v1(31.38,29.88)
  Bottom Layer w0.15: v1(25.25,20.62) 25.25,21.84 28.22,24.81 28.22,25.95 31.38,29.1 v1(31.38,29.88)
CURR_C: length 34.7
  Top Layer w0.15: v1(45,32) 45.25,32.25 45.25,35.75 C117.2 R96.1 ; U15.14 24.04,19.25 24.04,19.25 24.46,19.25 24.46,19.25 24.98,19.25 v1(26.18,20.45)
  Bottom Layer w0.15: v1(45,32) 44.21,32 43.71,31.5 37.3,31.5 35.37,29.58 33.12,29.58 29.12,25.58 29.12,24.44 26.87,22.19 26.87,21.25 26.18,20.55 v1(26.18,20.45)
DEBUG_RX: length 43.1
  Top Layer w0.15: v1(26.25,19.75) 26.1,19.6 26.05,19.6 23.25,16.8 7.08,16.8 5.9,17.98 R121.1 R116.1 4.1,16.98 3.15,16.03 3.15,15.76 2.52,15.13 1.63,15.13 1,15.76 1,17.67 J9.3 ; U15.53 30.25,24.01 v1(28.56,22.32)
  Bottom Layer w0.15: v1(28.56,22.32) 28.09,21.84 28.09,20.23 27.58,19.72 26.28,19.72 v1(26.25,19.75)
DEBUG_TX: length 49.6
  Top Layer w0.15: J9.4 2.3,16.21 R122.1 3.97,17.98 3.15,18.8 3.15,19.19 2.52,19.82 1.63,19.82 0.7,18.89 0.7,15.64 1.5,14.83 4.96,14.83 6.62,16.5 23.38,16.5 25.5,18.62 25.87,18.62 v1(26.29,19.05) ; v1(28.6,21.52) 30.75,23.67 U15.52
  Bottom Layer w0.15: v1(26.29,19.05) 26.66,19.42 27.7,19.42 28.6,20.32 v1(28.6,21.52)
INBRAKE: length 24.1
  Top Layer w0.15: v1(26.25,14.75) U15.20 ; 42,21 42,22.72 R98.1 ; 42,21 42,19.75 40.5,18.25 v1(36.88,18.25) ; 42,21 42,21 R123.1
  Bottom Layer w0.15: v1(26.25,14.75) 28.04,14.75 31.54,18.25 31.96,18.25 31.96,18.25 32.37,18.25 32.37,18.25 32.79,18.25 32.79,18.25 v1(36.88,18.25)
INHA: length 16.9
  Top Layer w0.15: U20.2 27.87,34.14 27.72,33.99 v1(27.32,33.99) ; v1(25.12,24.38) 25.12,22.88 24.5,22.25 U15.8
  Bottom Layer w0.15: v1(27.32,33.99) 27.32,32.61 25.75,31.04 25.75,26.04 25.12,25.42 v1(25.12,24.38)
INHB: length 27
  Top Layer w0.15: v1(41.33,33.98) 41.98,33.98 R125.1 ; 42.1,34.07 41.87,34.3 U22.2 ; U15.9 25.92,21.75 v1(26.03,21.86)
  Bottom Layer w0.15: v1(26.03,21.86) 26.03,22.19 28.53,24.69 28.53,25.82 32.88,30.17 35.13,30.17 37.95,33 40.35,33 v1(41.33,33.98)
INHC: length 41.6
  Top Layer w0.15: U15.10 25.97,21.25 v1(26.06,21.15) ; R126.1 55.99,34.01 ; 55.99,34.01 55.87,34.14 U25.2 ; 55.99,34.01 v1(55.3,34.01)
  Bottom Layer w0.15: v1(26.06,21.15) 26.11,21.15 26.57,21.61 26.57,22.31 28.82,24.57 28.82,25.7 33,29.88 35.25,29.88 37.18,31.8 43.59,31.8 44.29,32.5 53.79,32.5 54.29,33 54.3,33 v1(55.3,34.01)
INLA: length 16.4
  Top Layer w0.15: v1(30.12,30.5) 30.12,34.25 29.13,35.24 U20.3 ; v1(26.75,25.25) 26.34,25.25 26.33,25.25 22.75,25.25 U15.2
  Bottom Layer w0.15: v1(30.12,30.5) 30.12,30.26 29.44,29.57 29.44,28.44 26.75,25.75 v1(26.75,25.25)
INLB: length 33.3
  Top Layer w0.15: v1(26.88,20.22) 27.28,19.82 27.28,18.84 28.25,17.88 U15.24 ; v1(44.5,31.5) 44.5,31.79 44.5,31.79 44.5,32.21 44.5,32.21 44.5,32.25 44.12,32.62 44.12,34.25 43.13,35.24 U22.3
  Bottom Layer w0.15: v1(44.5,31.5) 44.13,31.5 43.84,31.2 37.42,31.2 35.5,29.28 33.25,29.28 29.43,25.45 29.43,24.92 29.43,24.91 29.43,24.32 27.17,22.06 27.17,21.12 26.88,20.83 v1(26.88,20.22)
INLC: length 45.5
  Top Layer w0.15: U25.3 57.13,35.11 58,34.25 58,32.38 55.62,30 v1(55.5,30) ; v1(27.58,20.44) 27.58,18.97 28.75,17.8 U15.25
  Bottom Layer w0.15: v1(27.58,20.44) 27.58,20.57 27.47,20.68 27.47,21.94 29.73,24.19 29.73,25.33 33.37,28.97 35.62,28.97 36.52,29.88 55.38,29.88 v1(55.5,30)
NRST: length 43.2
  Top Layer w0.15: J8.2 4.28,36.26 4.28,27.56 4.83,27.02 4.83,21.45 5.12,21.15 11.9,21.15 v1(14.12,23.38) ; C164.2 R99.1 U15.7 23.87,22.75 v1(24.25,23.13)
  Bottom Layer w0.15: v1(14.12,23.38) 15.38,23.38 15.62,23.13 v1(24.25,23.13)
OUT_A: length 30
  Top Layer w0.3: U20.6 v1(29.13,42.75) C151.1
  Top Layer w1: 28,64.5 J1.2 25.5,64.5 ; 25.5,69.5 J1.3 28,69.5 ; 19,69.5 J1.4 21.5,69.5 ; 19.85,64.5 19,64.5 ; 19.96,64.5 21.5,64.5
  Inner2 w0.25: v1(29.13,42.75) 26.32,42.75 24,45.07 v1(24,56.38)
OUT_B: length 30
  Top Layer w0.3: U22.6 v1(43.13,42.75) C143.1
  Top Layer w1: 39.5,64.5 J2.2 42,64.5 ; 33,69.5 J2.4 35.5,69.5 ; 42,69.5 J2.3 39.5,69.5 ; 33.85,64.5 33,64.5 ; 33.96,64.5 35.5,64.5
  Inner2 w0.25: v1(43.13,42.75) 40.32,42.75 38,45.07 v1(38,56.38)
OUT_BRAKE: length 16.9
  Top Layer w0.3: U28.6 51.44,22.94 C154.1 53.5,22.5 53.5,18.5
  Top Layer w0.5: D7.2 58,7.5
OUT_C: length 30
  Top Layer w0.3: C145.1 v1(57.13,42.75) U25.6
  Top Layer w1: 47,69.5 J3.4 49.5,69.5 ; 47.96,64.5 49.5,64.5 ; 53.5,64.5 J3.2 56,64.5 ; 53.5,69.5 J3.3 56,69.5 ; 47.85,64.5 47,64.5
  Inner2 w0.25: v1(57.13,42.75) 54.32,42.75 52,45.07 v1(52,56.38)
SUPPLY_ADC: length 60.1
  Top Layer w0.15: v1(24.75,13.62) U15.17 ; R92.1 C126.2 71.5,15.83 R91.2 v1(70.38,15.62)
  Bottom Layer w0.15: v1(24.75,13.62) 24.75,10.62 29.12,6.25 61,6.25 v1(70.38,15.62)
SWCLK: length 46.9
  Top Layer w0.15: v1(15,22.12) 13.42,20.55 4.88,20.55 4.22,21.2 4.22,26.77 3.68,27.31 3.68,31.78 J8.4 ; U15.50 31.63,27.87 31.63,28.76 31.41,28.98 30.52,28.98 v1(30.25,29.25)
  Bottom Layer w0.15: v1(15,22.12) 25.11,22.12 27.93,24.94 27.93,26.07 30.25,28.4 v1(30.25,29.25)
SWDIO: length 50.2
  Top Layer w0.15: v1(14.5,22.75) 12.6,20.85 5,20.85 4.53,21.32 4.53,26.89 3.98,27.43 3.98,34.02 J8.3 ; U15.49 32.25,28.63 31.61,29.28 31.22,29.28 v1(30.62,29.88)
  Bottom Layer w0.15: v1(30.62,29.88) 30.16,29.88 29.74,29.45 29.74,28.31 27.62,26.2 27.62,25.06 25.19,22.63 15.5,22.63 15.38,22.75 v1(14.5,22.75)
$1N1999: length 3.7
  Top Layer w0.15: R1.2 22,46 21,45 R85.2
$1N2053: length 3.2
  Top Layer w0.15: U2.4 R5.1 20.6,42.47 20.56,42.47 20.42,42.61 20.42,42.65 20.08,43 R86.1
$1N2445: length 8.6
  Top Layer w0.15: R82.1 R6.1 20.95,38.1 20.95,39.25 21.78,40.08 21.78,42.47 21.25,43 R85.1
$1N86489: length 5.8
  Top Layer w0.3: D3.1 26.59,40.06 U20.8 26.59,42.34 C151.2
$1N91606: length 28.9
  Top Layer w0.25: v1(27.88,39.88) 27.88,41.17 U20.7 ; R71.1 v1(27.5,58.25)
  Inner2 w0.25: v1(27.5,58.25) 24.4,55.15 24.4,45.32 26.41,43.3 30.38,43.3 31.12,42.56 31.12,42 30.5,41.38 29.38,41.38 v1(27.88,39.88)
$1N91630: length 14.6
  Top Layer w0.25: R72.1 v1(20.5,48) ; U20.5 v1(30.41,42.5)
  Inner2 w0.25: v1(20.5,48) 26.3,42.2 30.1,42.2 v1(30.41,42.5)
$1N91711: length 2.4
  Top Layer w0.35: Q2.1 20.32,50.58 20.5,50.4
$1N98362: length 3.7
  Top Layer w0.15: R87.2 35,45 36,46 R47.2
$1N98363: length 3.2
  Top Layer w0.15: R88.1 34.08,43 34.42,42.65 34.42,42.61 34.56,42.47 34.6,42.47 R44.1 U23.4
$1N98364: length 8.6
  Top Layer w0.15: R87.1 35.25,43 35.78,42.47 35.78,40.08 34.95,39.25 34.95,38.1 R45.1 R83.1
$1N98377: length 5.8
  Top Layer w0.3: D4.1 40.59,40.06 U22.8 40.59,42.34 C143.2
$1N98378: length 29
  Top Layer w0.25: U22.7 41.88,41.17 v1(41.88,39.88) ; R73.1 v1(41.5,58.25)
  Inner2 w0.25: v1(41.88,39.88) 43.5,41.5 44.62,41.5 45.12,42 45.12,42.56 44.38,43.3 40.33,43.3 38.4,45.23 38.4,55.15 v1(41.5,58.25)
$1N98379: length 14.6
  Top Layer w0.25: R74.1 v1(34.5,48) ; U22.5 v1(44.41,42.5)
  Inner2 w0.25: v1(44.41,42.5) 44.1,42.2 40.3,42.2 v1(34.5,48)
$1N98380: length 3.6
  Top Layer w0.25: R73.2 42.6,60.9 43.79,59.71 Q7.1
$1N98381: length 2.3
  Top Layer w0.35: 34.5,50.4 34.31,50.59 Q8.1
$1N98383: length 5.2
  Top Layer w0.15: R95.2 33.05,38.1 33.05,39.25 33.8,40 R44.2
$1N99332: length 3.7
  Top Layer w0.15: R89.2 49,45 50,46 R54.2
$1N99333: length 3.2
  Top Layer w0.15: U26.4 R51.1 48.6,42.47 48.56,42.47 48.42,42.61 48.42,42.65 48.08,43 R90.1
$1N99334: length 8.6
  Top Layer w0.15: R89.1 49.25,43 49.78,42.47 49.78,40.08 48.95,39.25 48.95,38.1 R52.1 R84.1
$1N99347: length 5.8
  Top Layer w0.3: C145.2 54.59,42.34 U25.8 54.59,40.06 D5.1
$1N99348: length 28.9
  Top Layer w0.25: R75.1 v1(55.5,58.25) ; U25.7 55.88,41.17 v1(55.88,39.88)
  Inner2 w0.25: v1(55.88,39.88) 57.38,41.38 58.5,41.38 59.12,42 59.12,42.56 58.38,43.3 54.33,43.3 52.5,45.13 52.5,55.25 v1(55.5,58.25)
$1N99349: length 14.6
  Top Layer w0.25: R76.1 v1(48.5,48) ; U25.5 v1(58.41,42.5)
  Inner2 w0.25: v1(48.5,48) 54.3,42.2 58.1,42.2 v1(58.41,42.5)
$1N99350: length 3.6
  Top Layer w0.25: R75.2 56.6,60.9 57.79,59.71 Q9.1
$1N99351: length 2.3
  Top Layer w0.35: R76.2 48.32,50.83 46.25,50.83
$1N99353: length 5.2
  Top Layer w0.15: R96.2 47.05,38.1 47.05,39.25 47.8,40 R51.2
$1N100317: length 4.6
  Top Layer w0.3: D6.1 50.79,26.43 U28.8 51.52,25.48 C154.2
$1N100319: length 5.2
  Top Layer w0.25: R77.1 48.94,21.67 U28.5
$1N100321: length 2.7
  Top Layer w0.25: Q12.1 48.34,18.61 R77.2
$1N100324: length 1.7
  Top Layer w0.15: R97.1 44.22,24.21 U28.2
$1N106583: length 1.2
  Top Layer w0.15: R93.2 72.5,15.42 R91.1
$1N106649: length 5.2
  Top Layer w0.15: R94.2 19.05,38.1 19.05,39.17 19.8,39.92 R5.2
$1N106964: length 1.8
  Top Layer w0.15: U28.3 44.49,22.94 R98.2
$2N1335: length 9.1
  Top Layer w0.15: U12.2 7.99,38.5 7,37.51 C138.1
  Top Layer w0.5: U12.2 9,38.5 10,39.5 10,40 11.85,41.85 L1.1
$2N1336: length 7
  Top Layer w0.15: U12.4 5.76,39.45 5.17,38.86 5.17,36.25 6.05,35.38 6,35.33 R39.1 6,33.17 C109.1
$2N1343: length 1.1
  Top Layer w0.15: C138.2 6,37.35 U12.6
$2N8525: length 6
  Top Layer w0.15: U29.2 8,27 7.75,26.75 7.25,26.75 6.75,26.25 C137.1
  Top Layer w0.5: 10.9,27.5 10.78,27.62 9.25,27.62 8.62,27 U29.2
$2N8526: length 6.6
  Top Layer w0.15: U29.4 5.76,27.95 5.17,27.36 5.17,24.58 R81.2 R80.1 5.75,21.92 C54.1
$2N8532: length 1.1
  Top Layer w0.15: C137.2 5.8,25.05 U29.6
$3N1136: length 8.9
  Top Layer w0.15: v1(33.75,33.25) R107.1
  Bottom Layer w0.15: U5.3 35.99,38.14 36.75,37.37 36.75,36.04 36.38,35.67 36.16,35.67 36,35.5 36,35.38 35.7,35.08 35.58,35.08 v1(33.75,33.25)
$3N1142: length 13.2
  Top Layer w0.15: U15.43 35.5,23.25 36.38,22.38 36.38,20.62 37.5,19.5 39,19.5 39.93,20.43 U16.6 39.93,23.32 39.25,24 R102.1
$3N1151: length 15.9
  Top Layer w0.15: R103.1 39,25 41.2,22.8 U16.5 41.2,20.45 39.95,19.2 37.38,19.2 36.07,20.5 36.07,22.25 35.58,22.75 U15.42
$3N1659: length 7.8
  Top Layer w0.15: U15.6 22.72,23.28 19.56,23.28 19.31,23.03 19.31,21.53 18.45,20.67 X1.3 18.12,20.24 C46.2
$3N1660: length 7.8
  Top Layer w0.15: X1.1 17.12,23.14 C47.2 17.72,24.72 19.28,24.72 20.25,23.75 U15.5
$3N1664: length 1.8
  Top Layer w0.25: R106.2 U15.61
$3N11685: length 17
  Top Layer w0.15: v1(32.12,20.62) 31.65,21.1 31.65,25.71 33.25,27.31 33.25,29.38 32,30.62 C4.2 R107.2 ; U15.34 v1(32.58,18.75)
  Bottom Layer w0.15: v1(32.12,20.62) 32.58,20.17 v1(32.58,18.75)
$3N12926: length 22.6
  Top Layer w0.15: U15.40 32.95,21.75 31.95,22.75 31.95,25.58 32.92,26.55 33.63,26.55 35.12,28.05 35.12,28.62 R104.1 34.93,30.57 v1(34.93,30.69)
  Bottom Layer w0.15: U5.7 38.62,36.86 37,35.25 37,32.47 35.22,30.69 v1(34.93,30.69)
$3N12927: length 26.9
  Top Layer w0.15: U15.41 32.88,22.25 32.25,22.88 32.25,25.46 33.04,26.25 33.75,26.25 R105.1 36.11,28.39 36.13,28.39 36.61,27.92 37.88,27.92 38.25,28.29 38.25,29.5 37.62,30.12 36.5,30.12 v1(35.22,31.4)
  Bottom Layer w0.15: v1(35.22,31.4) 35.51,31.4 36.7,32.6 36.7,35.37 39.46,38.14 U5.6
$3N23039: length 14.8
  Top Layer w0.15: U15.22 27.25,14.08 29.07,12.25 32.37,12.25 v1(32.75,11.88) ; R118.1 36.75,11.77 36.75,12.25 35.54,13.45 U6.1 34.66,12.53 v1(34,11.88)
  Bottom Layer w0.15: v1(34,11.88) v1(32.75,11.88)
$3N23065: length 19
  Top Layer w0.15: U15.30 31.25,15.37 31.66,14.96 35.17,14.96 37.55,12.58 38.38,12.58 39.12,11.83 v1(39.62,11.83) ; v1(42.75,11.88) 43.16,12.28 U7.1 44.04,13.45 45.25,12.25 R120.1
  Bottom Layer w0.15: v1(42.75,11.88) 42.37,11.5 39.96,11.5 v1(39.62,11.83)
$3N23090: length 16.9
  Top Layer w0.15: 46.25,11.75 46.25,11.77 43.37,14.66 40,14.66 39.34,14 U7.4 37.54,13.45 35.75,15.25 35.75,16.25 34.25,17.75 U15.33
$3N26572: length 1.1
  Top Layer w0.15: LED1.2 18.75,33.05 19.45,33.05 R108.2
$3N26583: length 23.2
  Top Layer w0.15: v1(24.38,24.62) 24.7,24.95 25.38,24.95 25.75,24.58 25.75,22.98 29.25,19.48 29.25,17.96 29.25,17.96 29.25,17.54 29.25,17.54 U15.26 ; v1(23.98,32.26) 23.87,32.15 21.35,32.15 20.74,32.76 20.56,32.76
  Bottom Layer w0.15: v1(23.98,32.26) 24.63,31.62 24.63,26.04 24.62,26.04 24.62,24.88 v1(24.38,24.62)
$3N27118: length 1
  Top Layer w0.15: R109.2 18.67,32 LED2.2
$3N27200: length 1
  Top Layer w0.15: LED3.2 R110.2
$3N27282: length 1
  Top Layer w0.15: 18.61,29.76 19.56,29.76
$3N27364: length 1
  Top Layer w0.15: 19.56,28.76 18.61,28.76
$3N27446: length 1
  Top Layer w0.15: LED6.2 R113.2
$3N27528: length 1
  Top Layer w0.15: LED7.2 R114.2
$3N27610: length 1
  Top Layer w0.15: LED8.2 R115.2
$3N27616: length 11
  Top Layer w0.15: 20.56,31.76 26.75,31.76 28.75,29.76 U15.56
$3N27622: length 10.7
  Top Layer w0.15: U15.57 28.25,29.83 26.62,31.46 23.21,31.46 22.75,31 20.8,31 20.56,30.76
$3N27629: length 10.5
  Top Layer w0.15: 20.56,29.76 20.67,29.88 22.05,29.88 23.34,31.16 26.5,31.16 27.75,29.91 U15.58
$3N27636: length 10.2
  Top Layer w0.15: 20.56,28.76 21.36,28.76 23.46,30.86 26.37,30.86 27.25,29.98 U15.59
$3N27643: length 10.1
  Top Layer w0.15: 20.56,27.76 20.57,27.75 21.12,27.75 21.38,28 21.38,28.35 23.58,30.56 26.25,30.56 26.78,30.03 26.78,27.78 U15.60
$3N27650: length 7.9
  Top Layer w0.15: v1(24.12,26.25) 24.75,25.62 25.34,25.62 25.75,26.04 25.75,27.5 25.75,27.5 U15.62 ; v1(22.12,26.75) 21.88,26.5 20.62,26.5 20.56,26.57 20.56,26.76
  Bottom Layer w0.15: v1(22.12,26.75) 23.62,26.75 v1(24.12,26.25)
$3N27657: length 18.4
  Top Layer w0.15: v1(26.25,24.62) 26.25,22.9 29.78,19.37 34.13,19.37 U15.35 ; v1(21,24.38) 21,24.88 20.56,25.32 20.56,25.64
  Bottom Layer w0.15: v1(26.25,24.62) 25.5,23.87 21.5,23.87 v1(21,24.38)
$3N32995: length 1
  Top Layer w0.15: LED10.1 36.76,9.81 R118.2
$3N32999: length 1
  Top Layer w0.15: 37.75,10.75 37.75,9.8
$3N33393: length 1
  Top Layer w0.15: 46.25,10.75 46.25,9.8
$3N33395: length 1
  Top Layer w0.15: R120.2 LED12.1
$3N33436: length 18.6
  Top Layer w0.15: v1(40.62,12) 40.62,13.44 U7.3 U7.2 41.88,11.98 42.49,11.38 44.12,11.38 R100.2 ; U15.36 35.62,19.75 36.12,19.25 36.12,15.62 37.5,14.25 v1(38.25,14.25)
  Bottom Layer w0.15: v1(40.62,12) 38.38,14.25 v1(38.25,14.25)
$3N35723: length 8
  Top Layer w0.15: R122.2 3.62,19.42 3.62,25.82 2.93,26.52
$3N35726: length 9.5
  Top Layer w0.15: R121.2 5.07,19.93 3.92,21.08 3.92,26.64 3.05,27.52 2.93,27.52
$3N35910: length 1.1
  Top Layer w0.15: R123.2 43.23,22 LED15.2
$3N38475: length 1.1
  Top Layer w0.15: LED16.2 29,33.3 R124.2
$3N38556: length 1.1
  Top Layer w0.15: R125.2 43,33.3 LED17.2
$3N38641: length 1.1
  Top Layer w0.15: LED18.2 57,33.3 R126.2
$3N45407: length 15.4
  Top Layer w0.15: U15.23 27.75,14 29,12.75 30.62,12.75 30.84,12.97 U6.4 30.84,14 31.5,14.66 34.87,14.66 37.75,11.77 37.75,11.75
$3N45415: length 31.7
  Top Layer w0.15: 33.38,11.37 29.13,11.37 v1(27,13.5) ; 33.38,11.37 34.46,11.37 34.46,11.38 35.62,11.38 R101.2 35.75,12.25 v1(35.5,12.5) ; 33.38,11.37 U6.2 U6.3 ; v1(32.75,24.38) 33.13,24.75 U15.46
  Bottom Layer w0.15: v1(32.75,24.38) 30.5,22.12 30.5,17.63 28.12,15.25 26.04,15.25 25.75,14.96 25.75,14.13 26.38,13.5 v1(27,13.5)
$1N91671: length 3.6
  Top Layer w0.25: R71.2 28.64,60.9 29.73,59.81 29.73,58.98 Q1.1

## Copper pours and planes (outline as drawn; the poured copper is in the pictures)
3V3 on Top Layer: 7.88,23 7.88,21.25 11.12,21.25 11.12,22.97 11.1,23
3V3 on Inner2: -1,40.88 59,40.88 59,-1 -1,-1
12V on Top Layer: 35.46,32.8 38.2,32.8 40,31 48.06,31 50,32.94 50,31.62 48.12,29.75 39.88,29.75 37.88,31.75 36.5,31.75 35.46,32.79
12V on Top Layer: 8.38,33 14.88,33 14.88,31 8.38,31
12V on Bottom Layer: 33.52,32.5 32.65,33.38 31.5,33.38 28.33,36.54 23.33,36.54 20.28,33.5 9.28,33.5 8.4,32.63 8.4,31.03 6.88,29.5 19.86,29.5 25.11,34.75 27.38,34.75 30.38,31.75 34,31.75 34.75,32.5
24V on Top Layer: 30,57 25,57 25,47 30,47
24V on Top Layer: 8.25,30.62 9.25,30.62 9.25,28.88 8.25,28.88
24V on Top Layer: 7,31.12 9.25,31.12 9.25,30.38 7,30.38
24V on Top Layer: 58,57 53,57 53,47 58,47
24V on Top Layer: 44,57 39,57 39,47 44,47
24V on Top Layer: 8.38,42.88 9.88,42.88 9.88,39.25 8.38,39.25
24V on Top Layer: 60.5,61 60.5,49 64.5,49 64.5,61
24V on Top Layer: 14.5,49 14.5,61 10.5,61 10.5,49
24V on Bottom Layer: 10,76 10,47 65,47 65,76
24V on Bottom Layer: 77,24 67,24 59.5,48.5 57.78,77 77,77
24V on Bottom Layer: 19.19,-1.5 18.95,16.04 8.38,31 8.38,34.75 15.5,48.5 15.5,76.5 -1.5,76.5 -1.5,-1.5
GND on Top Layer: 44.65,18.8 43.38,18.8 43.38,14.38 46,14.38 45.62,17.43
GND on Top Layer: 7.3,26.05 7.3,24.45 7.88,23.88 11.16,23.88 11.16,25 9.59,25 9.59,26.05
GND on Top Layer: 7.88,37.88 14.91,37.88 14.91,34.25 7.88,34.25
GND on Top Layer: 69.5,61 69.5,45.12 73.5,45.12 73.5,61
GND on Top Layer: 11,45 13,45 13,48 18.5,48 18.5,43.5 11,43.5
GND on Top Layer: 5.5,46 5.5,61 1.5,61 1.5,46
GND on Top Layer: 4.38,30.5 6.25,30.5 6.25,27.88 4.38,27.88
GND on Top Layer: 25,45 27,45 27,48 32.5,48 32.5,43.5 25,43.5
GND on Top Layer: 13.5,43.5 13.5,48 1.5,48 1.5,43.5
GND on Top Layer: 53,45 55,45 55,48 60.5,48 60.5,43.5 53,43.5
GND on Top Layer: 6.5,42 4.5,42 4.5,39.38 5.5,39.38 6.5,40.38
GND on Top Layer: 57.25,48 57.25,43.5 73.5,43.5 73.5,48
GND on Top Layer: 39,45 41,45 41,48 46.5,48 46.5,43.5 39,43.5
GND on Inner1: -1,75.75 76,75.75 76,-1.25 -1,-1.25
GND on Inner2: 4,31 10.5,31 10.5,24.25 4,24.25
GND on Inner2: -1.5,76.5 77,76.5 77,41 -1.5,41
GND on Inner2: 4,42.5 10.5,42.5 10.5,36 4,36
OUT_A on Top Layer: 18.5,71.5 18.5,61.75 18,60.5 18,56 26.5,56 28.5,63 28.5,71.5
OUT_B on Top Layer: 32.5,71.5 32.5,61.75 32,60.5 32,56 40.5,56 42.5,63 42.5,71.5
OUT_BRAKE on Top Layer: 52.93,14.16 55.83,9.24 56.35,9.54 52.75,15.93 52.75,19.01 58.43,18.85 62.05,-0.5 51,-0.5 51,11.06 52.5,11.27
OUT_C on Top Layer: 46.5,71.5 46.5,61.75 46,60.5 46,56 54.5,56 56.5,63 56.5,71.5
$1N1999 on Top Layer: 21.5,53 25,53 25,43.5 22.5,43.5 22.5,48 21.5,48
$1N98362 on Top Layer: 35.5,53 39,53 39,43.5 36.5,43.5 36.5,48 35.5,48
$1N99332 on Top Layer: 49.5,53 53,53 53,43.5 50.5,43.5 50.5,48 49.5,48

## Text on the board
Bottom Silkscreen Layer: pcb-bldc-high-current v2 / by ftobler 2025
Top Silkscreen Layer: nc. / GND / RX >> / TX << / nc. / nc. | (nominal) | A | (1) | B | C | (2) | G-A-B | RST | DIO | CLK | 3V3 | +24V | U | GND | V | W
